# EAGLE design LCDShield (EAGLE 9.6.2)
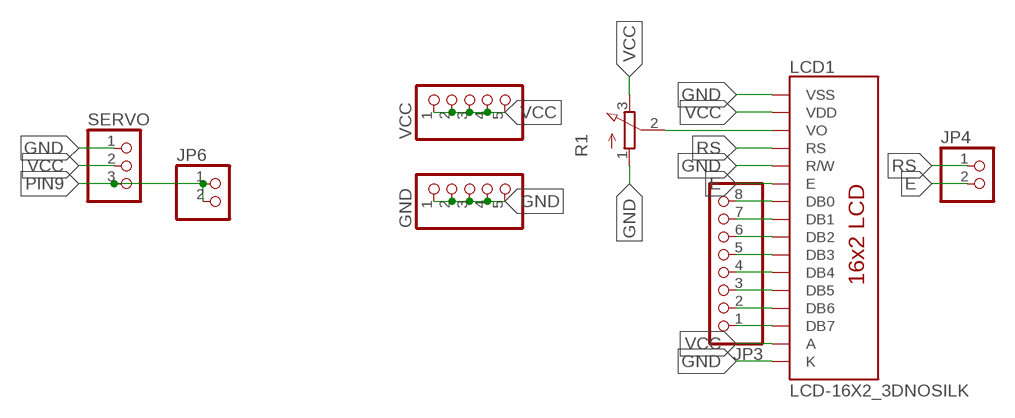
[diagram p0: schematic, sheet 1]

## Parts
GND  PINHD-1X5  [1X05]
JP3  PINHD-1X8  [1X08]
JP4  PINHD-1X2  [1X02]
JP6  PINHD-1X2  [1X02]
LCD1  LCD-16X2_3DNOSILK  [LCD-16X2_NOSILK]
R1  3RP/1610N  [3RP/1610N]
SERVO  PINHD-1X3  [1X03]
VCC  PINHD-1X5  [1X05]

## Nets
E: JP4.2 LCD1.6(E)
GND: GND.1 GND.2 GND.3 GND.4 GND.5 LCD1.1(VSS) LCD1.5(R/W) LCD1.16(K) R1.1(A) SERVO.1
N$2: JP3.8 LCD1.7(DB0)
N$3: JP3.7 LCD1.8(DB1)
N$4: JP3.6 LCD1.9(DB2)
N$5: JP3.5 LCD1.10(DB3)
N$6: JP3.4 LCD1.11(DB4)
N$7: JP3.3 LCD1.12(DB5)
N$8: JP3.2 LCD1.13(DB6)
N$9: JP3.1 LCD1.14(DB7)
N$15: LCD1.3(VO) R1.2(S)
PIN9: JP6.1 JP6.2 SERVO.3
RS: JP4.1 LCD1.4(RS)
VCC: LCD1.2(VDD) LCD1.15(A) R1.3(E) SERVO.2 VCC.1 VCC.2 VCC.3 VCC.4 VCC.5

## Library data of the parts
GND VCC = pinhead:PINHD-1X5: PIN HEADER
JP3 = pinhead:PINHD-1X8: PIN HEADER
JP4 JP6 = pinhead:PINHD-1X2: PIN HEADER
LCD1 = MIA_LIBRARY-2-2-2:LCD-16X2_3D: Standard text-only 16x2 parallel input LCD Basic 16 character by 2 line display. Typically utilizes the extremely common HD44780 parallel interface chipset SparkFun Products: Basic 16x2 Green <https://www.sparkfun.com/products/255> Basic 8x2 Green <https://www.sparkfun.com/products/11122>; SF_ID: LCD-00255
R1 = pot:3RP/1610N: 16mm Potentiometer one level Source: http://www.alphapotentiometers.net/html/16mm_pot_2.html
SERVO = pinhead:PINHD-1X3: PIN HEADER

## Board
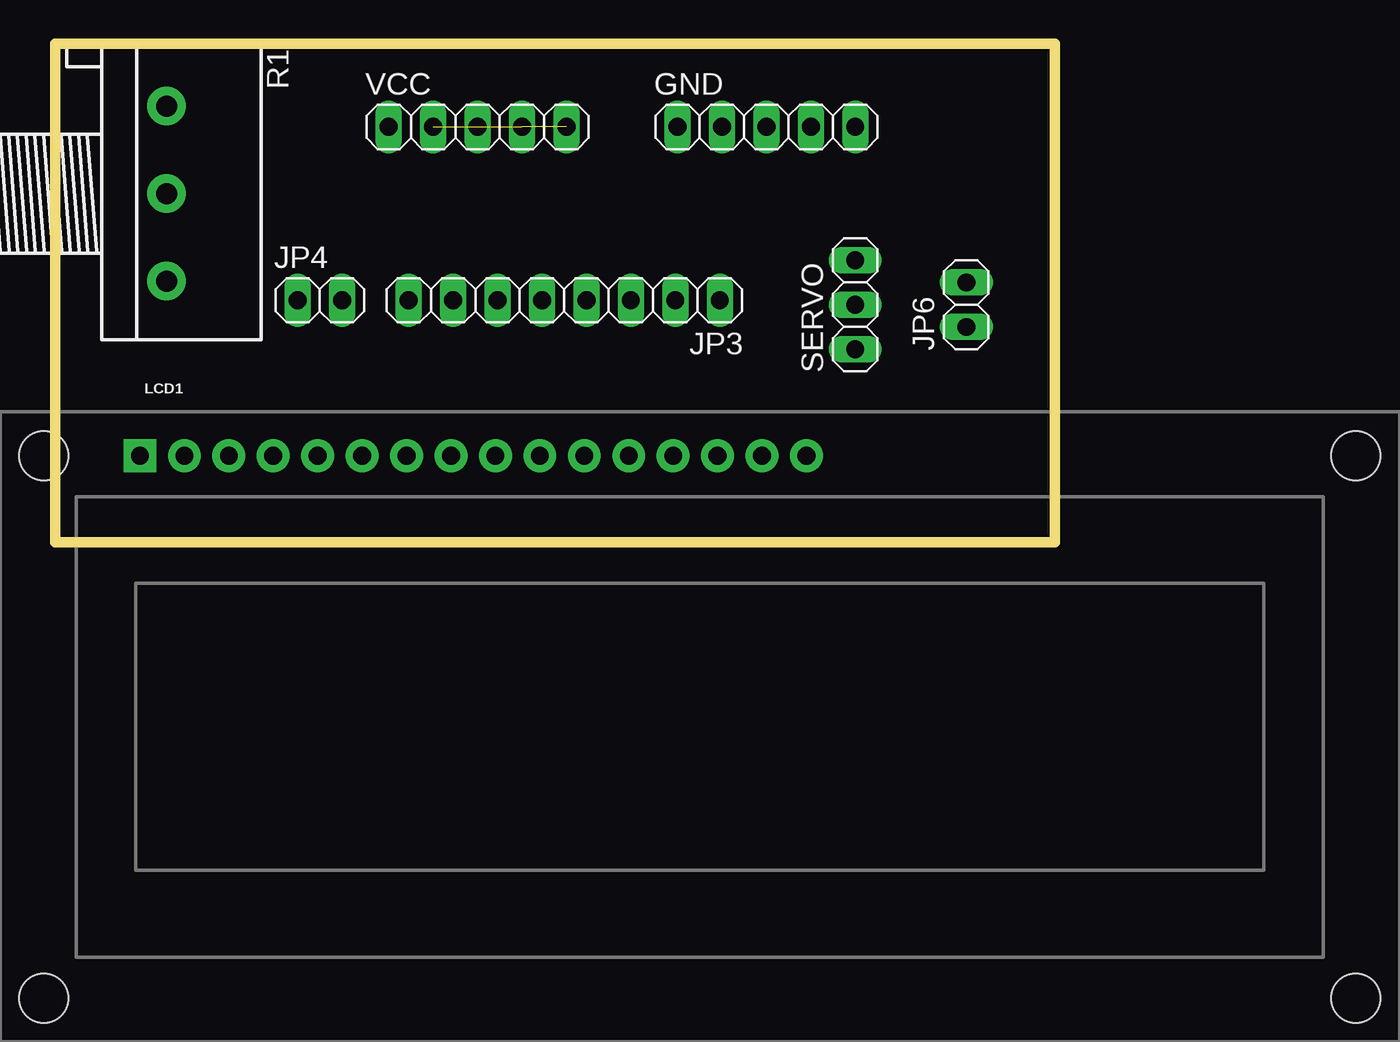
[diagram p1: board, top side]
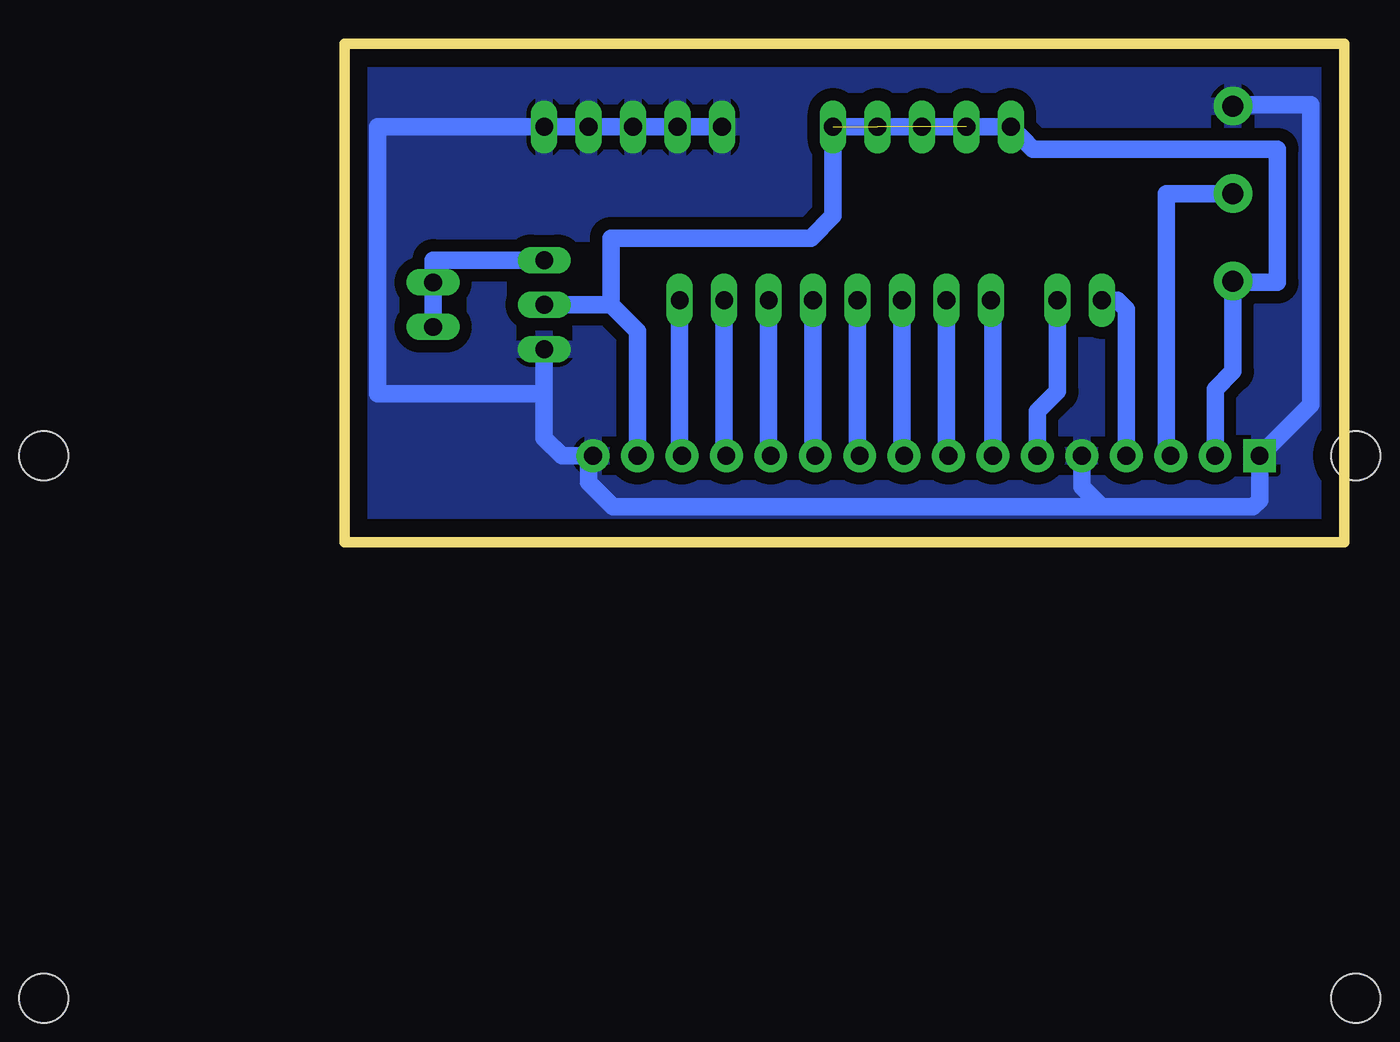
[diagram p2: board, bottom side, seen from below]

Size 57.13 x 28.5 mm. Coordinates in mm from the lower left corner, seen from the top.
Outline: 0,0 57.13,0 57.13,28.5 0,28.5 0,0
Copper layers (1*16): Top 0.035mm / dielectric 1.5mm / Bottom 0.035mm
Design rules "default *": minimum track width 0.7mm, minimum drill 0.35mm, track to track 0.7mm, track to pad 0.7mm, pad to pad 6mil, via to via 6mil, smd to smd 6mil, copper to edge 40mil, drill to drill 6mil, minimum pad ring 10mil, minimum via ring 8mil, stop-mask expansion 4mil, vias tented up to drill 0mil, thermal gap 10mil

### Footprints (pad centres in the part's own frame; a part is rotated, then mirrored left to right if it is on the bottom)
1X05 = drill 1.016 long: 1 -5.08,0; 2 -2.54,0; 3 0,0; 4 2.54,0; 5 5.08,0
1X08 = drill 1.016 long: 1 -8.89,0; 2 -6.35,0; 3 -3.81,0; 4 -1.27,0; 5 1.27,0; 6 3.81,0; 7 6.35,0; 8 8.89,0
1X02 = drill 1.016 long: 1 -1.27,0; 2 1.27,0
LCD-16X2_NOSILK = drill 1.016 pad 1.88 square: 1 -32,15.5 | drill 1.016 pad 1.88: 2 -29.46,15.5; 3 -26.92,15.5; 4 -24.38,15.5; 5 -21.84,15.5; 6 -19.3,15.5; 7 -16.76,15.5; 8 -14.22,15.5; 9 -11.68,15.5; 10 -9.14,15.5; 11 -6.6,15.5; 12 -4.06,15.5; 13 -1.52,15.5; 14 1.02,15.5; 15 3.56,15.5; 16 6.1,15.5 | hole 2.8: -37.5,15.5; -37.5,-15.5; 37.5,15.5; 37.5,-15.5
3RP/1610N = drill 1.2 pad 2.184: 1 -5,0; 2 0,0; 3 5,0
1X03 = drill 1.016 long: 1 -2.54,0; 2 0,0; 3 2.54,0

### Placement (x,y rotation side)
GND  40.64,23.75 0 top
JP3  29.08,13.84 180 top
JP4  15.11,13.84 0 top
JP6  52.07,13.59 90 top
LCD1  36.83,-10.54 0 top
R1  6.35,19.94 270 top
SERVO  45.72,13.59 90 top
VCC  24.13,23.75 0 top

### Tracks (layer width: path | path; a pad name or v marks a point on that pad's centre or on a via)
E
  Bottom 1: LCD1.6 17.53,7.49 16.38,8.64 JP4.2
GND
  Bottom 1: R1.1 6.27,25.02 1.91,25.02 1.91,7.88 LCD1.1 4.83,2.41 5.21,2.03 13.84,2.03 | 45.72,8.51 45.72,5.97 44.71,4.96 LCD1.16 43.18,4.71 43.18,3.43 41.78,2.03 13.84,2.03 | 45.72,8.51 SERVO.1 | 45.72,8.51 55.25,8.51 55.25,23.75 GND.5 GND.1 | LCD1.5 14.99,3.18 13.84,2.03
  pour Bottom: -1.27,30.1 58.42,30.1 58.42,-1.65 -1.27,-1.65
  pour Bottom (isolate 3, rank 2): 34.29,26.29 46.99,26.29 46.99,21.21 34.29,21.21
N$2
  Bottom 1: LCD1.7 20.07,13.72 JP3.8
N$3
  Bottom 1: LCD1.8 22.73,5.08 JP3.7
N$4
  Bottom 1: LCD1.9 25.27,5.08 JP3.6
N$5
  Bottom 1: LCD1.10 27.81,5.08 JP3.5
N$6
  Bottom 1: LCD1.11 30.35,5.08 JP3.4
N$7
  Bottom 1: LCD1.12 32.89,5.08 JP3.3
N$8
  Bottom 1: LCD1.13 35.43,5.08 JP3.2
N$9
  Bottom 1: LCD1.14 37.97,5.08 JP3.1
N$15
  Bottom 1: R1.2 10.16,19.94 10.16,5.21 LCD1.3
PIN9
  Bottom 1: JP6.1 JP6.2 52.07,16.13 SERVO.3
RS
  Bottom 1: LCD1.4 12.45,13.34 12.95,13.84 JP4.1
VCC  (3 unrouted)
  Bottom 1: LCD1.2 7.37,8.76 6.35,9.78 R1.3 6.27,14.86 3.81,14.86 3.81,22.48 17.78,22.48 18.41,23.11 VCC.1 VCC.5 29.21,18.67 30.48,17.4 41.91,17.4 41.91,13.59 | LCD1.15 40.39,12.07 41.91,13.59 | 41.91,13.59 SERVO.2